# EAGLE design RFBoardLayoutGen0_v03.3JK2 (EAGLE 7.5.0)
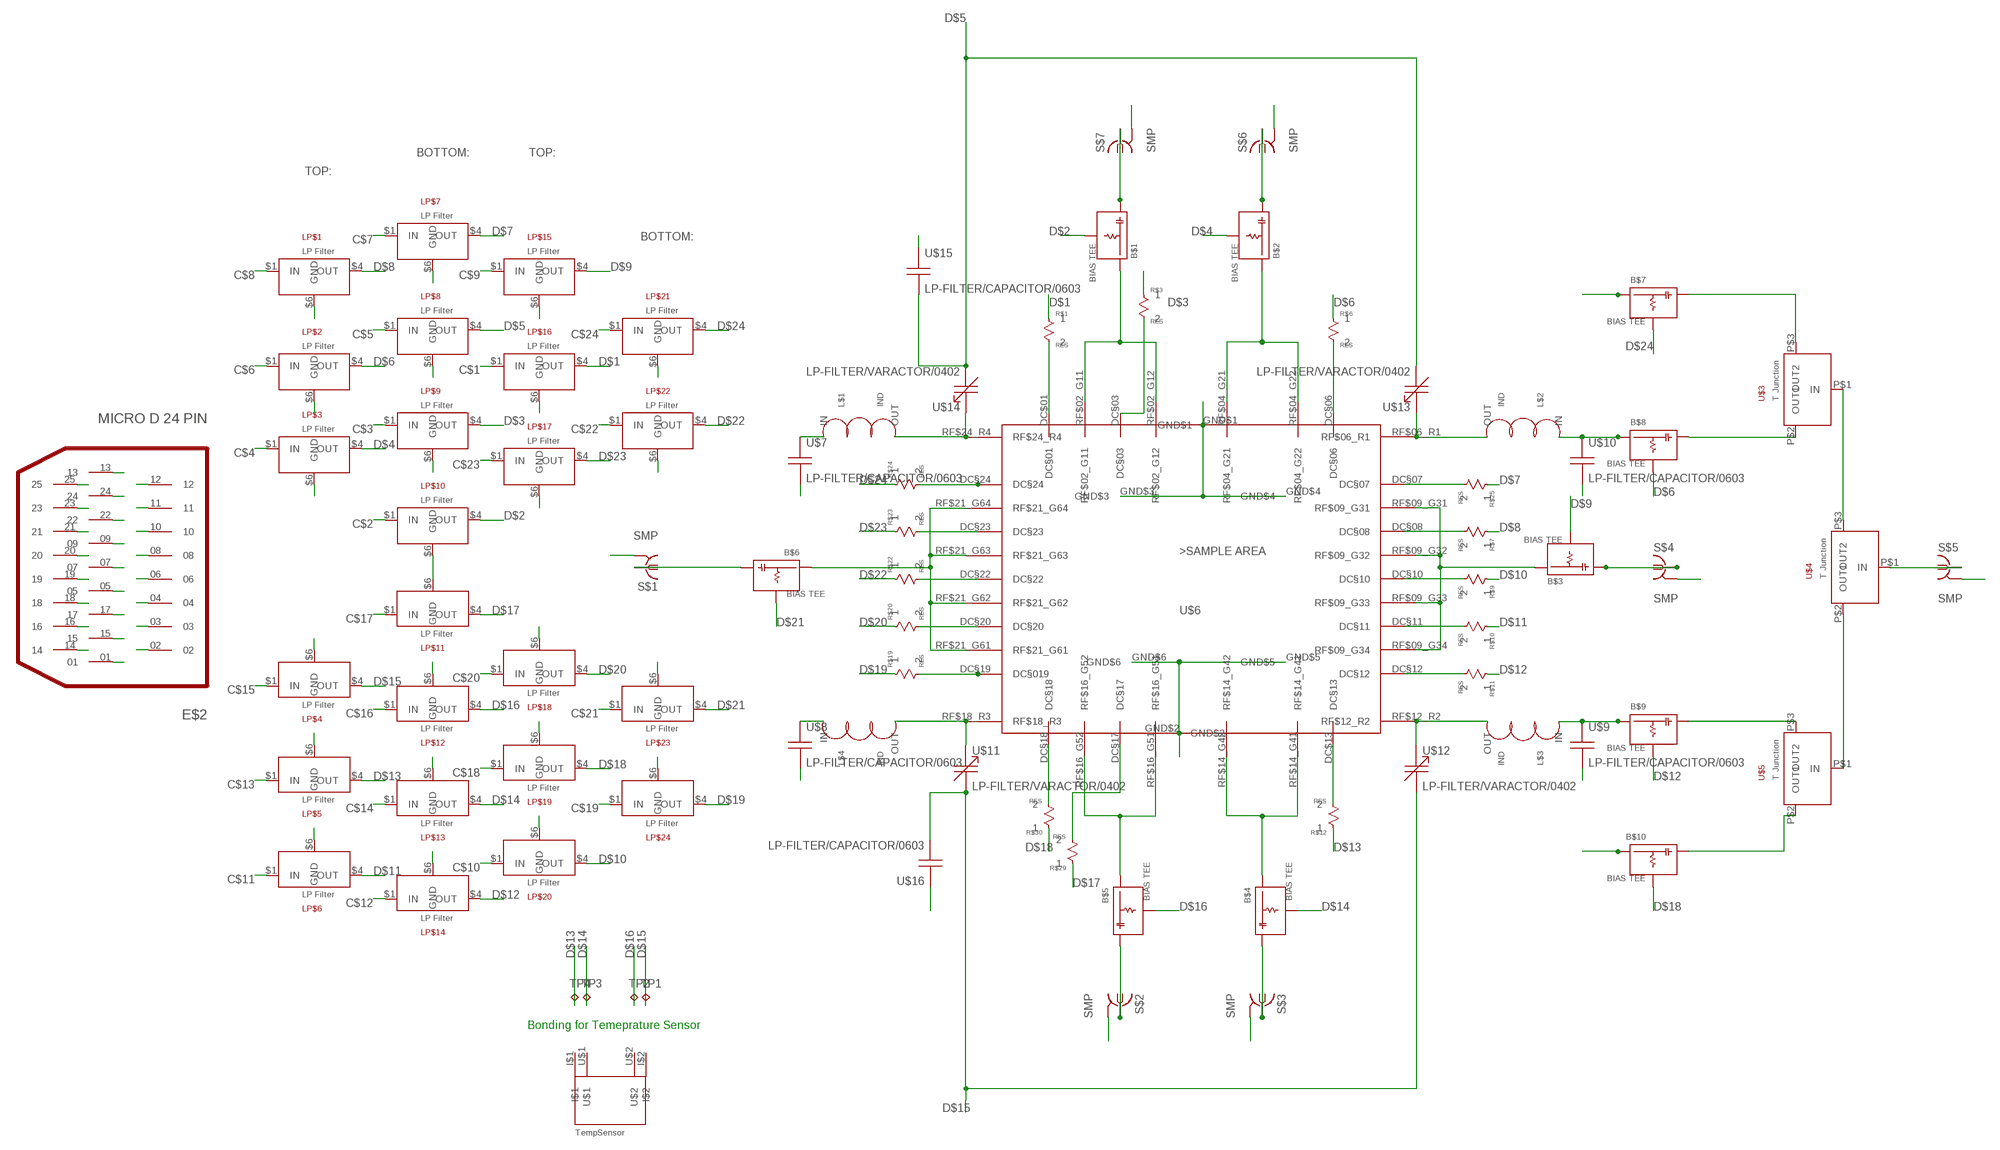
[diagram p0: schematic, sheet 1, part 1 of 2]
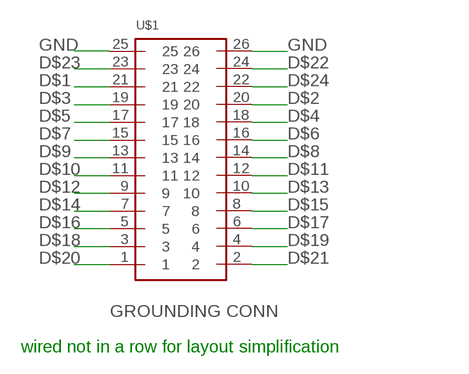
[diagram p1: schematic, sheet 1, part 2 of 2]

## Parts
B$1  BIASTEEDOWN  [BIAS_TEE_DOWN_0603]
B$2  BIASTEEUP  [BIAS_TEE_UP_0603]
B$3  BIASTEEDOWN  [BIAS_TEE_DOWN_0603]
B$4  BIASTEEDOWN  [BIAS_TEE_DOWN_0603]
B$5  BIASTEEUP  [BIAS_TEE_UP_0603]
B$6  BIASTEEDOWN  [BIAS_TEE_DOWN_0603]
B$7  BIASTEEUP  [BIAS_TEE_UP_0603]
B$8  BIASTEEDOWN  [BIAS_TEE_DOWN_0603]
B$9  BIASTEEUP  [BIAS_TEE_UP_0603]
B$10  BIASTEEDOWN  [BIAS_TEE_DOWN_0603]
E$2  25_SOCKET_M83513(13-DPINOUT2  [25_SOCKET_M83513/13-D_V2]
L$1  L_MATCH  [L_MATCH]
L$2  L_MATCH  [L_MATCH]
L$3  L_MATCH  [L_MATCH]
L$4  L_MATCH  [L_MATCH]
LP$1  LP-FILTER/1-STAGETOP  [LP-FILTER/1_STAGE/OS/0603_TOP]
LP$2  LP-FILTER/1-STAGETOP  [LP-FILTER/1_STAGE/OS/0603_TOP]
LP$3  LP-FILTER/1-STAGETOP  [LP-FILTER/1_STAGE/OS/0603_TOP]
LP$4  LP-FILTER/1-STAGETOP  [LP-FILTER/1_STAGE/OS/0603_TOP]
LP$5  LP-FILTER/1-STAGETOP  [LP-FILTER/1_STAGE/OS/0603_TOP]
LP$6  LP-FILTER/1-STAGETOP  [LP-FILTER/1_STAGE/OS/0603_TOP]
LP$7  LP-FILTER/1-STAGEBOT  [LP-FILTER/1_STAGE/OS/0603_BOTTOM]
LP$8  LP-FILTER/1-STAGEBOT  [LP-FILTER/1_STAGE/OS/0603_BOTTOM]
LP$9  LP-FILTER/1-STAGEBOT  [LP-FILTER/1_STAGE/OS/0603_BOTTOM]
LP$10  LP-FILTER/1-STAGEBOT  [LP-FILTER/1_STAGE/OS/0603_BOTTOM]
LP$11  LP-FILTER/1-STAGEBOT  [LP-FILTER/1_STAGE/OS/0603_BOTTOM]
LP$12  LP-FILTER/1-STAGEBOT  [LP-FILTER/1_STAGE/OS/0603_BOTTOM]
LP$13  LP-FILTER/1-STAGEBOT  [LP-FILTER/1_STAGE/OS/0603_BOTTOM]
LP$14  LP-FILTER/1-STAGEBOT  [LP-FILTER/1_STAGE/OS/0603_BOTTOM]
LP$15  LP-FILTER/1-STAGETOP  [LP-FILTER/1_STAGE/OS/0603_TOP]
LP$16  LP-FILTER/1-STAGETOP  [LP-FILTER/1_STAGE/OS/0603_TOP]
LP$17  LP-FILTER/1-STAGETOP  [LP-FILTER/1_STAGE/OS/0603_TOP]
LP$18  LP-FILTER/1-STAGETOP  [LP-FILTER/1_STAGE/OS/0603_TOP]
LP$19  LP-FILTER/1-STAGETOP  [LP-FILTER/1_STAGE/OS/0603_TOP]
LP$20  LP-FILTER/1-STAGETOP  [LP-FILTER/1_STAGE/OS/0603_TOP]
LP$21  LP-FILTER/1-STAGEBOT  [LP-FILTER/1_STAGE/OS/0603_BOTTOM]
LP$22  LP-FILTER/1-STAGEBOT  [LP-FILTER/1_STAGE/OS/0603_BOTTOM]
LP$23  LP-FILTER/1-STAGEBOT  [LP-FILTER/1_STAGE/OS/0603_BOTTOM]
LP$24  LP-FILTER/1-STAGEBOT  [LP-FILTER/1_STAGE/OS/0603_BOTTOM]
R$1  10K  LP-FILTER/RESISTOR/0603  [LP-FILTER/RESISTOR/0603_BOTTOM]
R$3  10K  LP-FILTER/RESISTOR/0603  [LP-FILTER/RESISTOR/0603_BOTTOM]
R$6  10K  LP-FILTER/RESISTOR/0603  [LP-FILTER/RESISTOR/0603_BOTTOM]
R$7  10K  LP-FILTER/RESISTOR/0603  [LP-FILTER/RESISTOR/0603_BOTTOM]
R$9  10K  LP-FILTER/RESISTOR/0603  [LP-FILTER/RESISTOR/0603_BOTTOM]
R$10  10K  LP-FILTER/RESISTOR/0603  [LP-FILTER/RESISTOR/0603_BOTTOM]
R$11  10K  LP-FILTER/RESISTOR/0603  [LP-FILTER/RESISTOR/0603_BOTTOM]
R$12  10K  LP-FILTER/RESISTOR/0603  [LP-FILTER/RESISTOR/0603_BOTTOM]
R$19  10K  LP-FILTER/RESISTOR/0603  [LP-FILTER/RESISTOR/0603_BOTTOM]
R$20  10K  LP-FILTER/RESISTOR/0603  [LP-FILTER/RESISTOR/0603_BOTTOM]
R$22  10K  LP-FILTER/RESISTOR/0603  [LP-FILTER/RESISTOR/0603_BOTTOM]
R$23  10K  LP-FILTER/RESISTOR/0603  [LP-FILTER/RESISTOR/0603_BOTTOM]
R$24  10K  LP-FILTER/RESISTOR/0603  [LP-FILTER/RESISTOR/0603_BOTTOM]
R$25  10K  LP-FILTER/RESISTOR/0603  [LP-FILTER/RESISTOR/0603_BOTTOM]
R$29  10K  LP-FILTER/RESISTOR/0603  [LP-FILTER/RESISTOR/0603_BOTTOM]
R$30  10K  LP-FILTER/RESISTOR/0603  [LP-FILTER/RESISTOR/0603_BOTTOM]
S$1  MC-921WIDE  [SMP_STRAIGHT_MINI_WIDE]
S$2  MC-921WIDE  [SMP_STRAIGHT_MINI_WIDE]
S$3  MC-921WIDE  [SMP_STRAIGHT_MINI_WIDE]
S$4  MC-921WIDE  [SMP_STRAIGHT_MINI_WIDE]
S$5  MC-921WIDE  [SMP_STRAIGHT_MINI_WIDE]
S$6  MC-921WIDE  [SMP_STRAIGHT_MINI_WIDE]
S$7  MC-921WIDE  [SMP_STRAIGHT_MINI_WIDE]
TP1  TPTP07SQ  [TP07SQ]
TP2  TPTP07SQ  [TP07SQ]
TP3  TPTP07SQ  [TP07SQ]
TP4  TPTP07SQ  [TP07SQ]
U$1  MEC8-113-02-L-D-RA1MBRD  [MEC8-113-02-L-D-RA1]
U$2  TEMPSENS  [RX-BR_V1]
U$3  TJUNCTION  [T_JUNCTION_0.3MM]
U$4  TJUNCTION  [T_JUNCTION_0.3MM]
U$5  TJUNCTION  [T_JUNCTION_0.3MM]
U$6  24DC+10RF_V2.0  [24DC+10RF/400MU-PADS/0.7X0.7_V2.0]
U$7  LP-FILTER/CAPACITOR/0603  [LP-FILTER/CAPACITOR/0603_BOTTOM]
U$8  LP-FILTER/CAPACITOR/0603  [LP-FILTER/CAPACITOR/0603_BOTTOM]
U$9  LP-FILTER/CAPACITOR/0603  [LP-FILTER/CAPACITOR/0603_BOTTOM]
U$10  LP-FILTER/CAPACITOR/0603  [LP-FILTER/CAPACITOR/0603_BOTTOM]
U$11  LP-FILTER/VARACTOR/0402  [LP-FILTER/VARACTOR/0402]
U$12  LP-FILTER/VARACTOR/0402  [LP-FILTER/VARACTOR/0402]
U$13  LP-FILTER/VARACTOR/0402  [LP-FILTER/VARACTOR/0402]
U$14  LP-FILTER/VARACTOR/0402  [LP-FILTER/VARACTOR/0402]
U$15  LP-FILTER/CAPACITOR/0603  [LP-FILTER/CAPACITOR/0603_BOTTOM]
U$16  LP-FILTER/CAPACITOR/0603  [LP-FILTER/CAPACITOR/0603_BOTTOM]

## Nets
C$1: E$2.01 LP$16.$1(IN)
C$2: E$2.02 LP$10.$1(IN)
C$3: E$2.03 LP$9.$1(IN)
C$4: E$2.04 LP$3.$1(IN)
C$5: E$2.05 LP$8.$1(IN)
C$6: E$2.06 LP$2.$1(IN)
C$7: E$2.07 LP$7.$1(IN)
C$8: E$2.08 LP$1.$1(IN)
C$9: E$2.09 LP$15.$1(IN)
C$10: E$2.10 LP$20.$1(IN)
C$11: E$2.11 LP$6.$1(IN)
C$12: E$2.12 LP$14.$1(IN)
C$13: E$2.13 LP$5.$1(IN)
C$14: E$2.14 LP$13.$1(IN)
C$15: E$2.15 LP$4.$1(IN)
C$16: E$2.16 LP$12.$1(IN)
C$17: E$2.17 LP$11.$1(IN)
C$18: E$2.18 LP$19.$1(IN)
C$19: E$2.19 LP$24.$1(IN)
C$20: E$2.20 LP$18.$1(IN)
C$21: E$2.21 LP$23.$1(IN)
C$22: E$2.22 LP$22.$1(IN)
C$23: E$2.23 LP$17.$1(IN)
C$24: E$2.24 LP$21.$1(IN)
D$1: LP$16.$4(OUT) R$1.IN U$1.21
D$2: B$1.LF LP$10.$4(OUT) U$1.20
D$3: LP$9.$4(OUT) R$3.IN U$1.19
D$4: B$2.LF LP$3.$4(OUT) U$1.18
D$5: LP$8.$4(OUT) U$1.17 U$13.OUT U$14.OUT U$15.OUT
D$6: B$8.LF LP$2.$4(OUT) R$6.IN U$1.16
D$7: LP$7.$4(OUT) R$25.IN U$1.15
D$8: LP$1.$4(OUT) R$7.IN U$1.14
D$9: B$3.LF LP$15.$4(OUT) U$1.13
D$10: LP$20.$4(OUT) R$9.IN U$1.11
D$11: LP$6.$4(OUT) R$10.IN U$1.12
D$12: B$9.LF LP$14.$4(OUT) R$11.IN U$1.9
D$13: LP$5.$4(OUT) R$12.IN TP4.TP U$1.10
D$14: B$4.LF LP$13.$4(OUT) TP3.TP U$1.7
D$15: LP$4.$4(OUT) TP1.TP U$1.8 U$11.OUT U$12.OUT U$16.OUT
D$16: B$5.LF LP$12.$4(OUT) TP2.TP U$1.5
D$17: LP$11.$4(OUT) R$29.IN U$1.6
D$18: B$10.LF LP$19.$4(OUT) R$30.IN U$1.3
D$19: LP$24.$4(OUT) R$19.IN U$1.4
D$20: LP$18.$4(OUT) R$20.IN U$1.1
D$21: B$6.LF LP$23.$4(OUT) U$1.2
D$22: LP$22.$4(OUT) R$22.IN U$1.24
D$23: LP$17.$4(OUT) R$23.IN U$1.23
D$24: B$7.LF LP$21.$4(OUT) R$24.IN U$1.22
DC$1 [RF2]: R$1.OUT U$6.DC$01(DC§01)
DC$3: R$3.OUT U$6.DC§03
DC$5 [RF2]: B$2.OUT U$6.RF$04_G21 U$6.RF$04_G22
DC$6: R$6.OUT U$6.DC§06
DC$10 [RF2]: B$3.OUT U$6.RF$09_G31 U$6.RF$09_G32 U$6.RF$09_G33 U$6.RF$09_G34
DC$13: R$12.OUT U$6.DC$13(DC§13)
DC$19: R$19.OUT U$6.DC§19(DC§019)
DC$20: R$20.OUT U$6.DC§20
DC$24: R$24.OUT U$6.DC§24
GND: E$2.25 LP$1.$6(GND) LP$2.$6(GND) LP$3.$6(GND) LP$4.$6(GND) LP$5.$6(GND) LP$6.$6(GND) LP$7.$6(GND) LP$8.$6(GND) LP$9.$6(GND) LP$10.$6(GND) LP$11.$6(GND) LP$12.$6(GND) LP$13.$6(GND) LP$14.$6(GND) LP$15.$6(GND) LP$16.$6(GND) LP$17.$6(GND) LP$18.$6(GND) LP$19.$6(GND) LP$20.$6(GND) LP$21.$6(GND) LP$22.$6(GND) LP$23.$6(GND) LP$24.$6(GND) S$1.2@1(GND) S$1.2@2(GND) S$2.2@1(GND) S$2.2@2(GND) S$3.2@1(GND) S$3.2@2(GND) S$4.2@1(GND) S$4.2@2(GND) S$5.2@1(GND) S$5.2@2(GND) S$6.2@1(GND) S$6.2@2(GND) S$7.2@1(GND) S$7.2@2(GND) U$1.25 U$1.26 U$6.GND$1 U$6.GND$2 U$6.GND$3 U$6.GND$4 U$6.GND$5 U$6.GND$6 U$7.OUT U$8.OUT U$9.OUT U$10.OUT U$15.IN U$16.IN
N$1 [RF2]: B$6.HF S$1.1
N$2: L$3.OUT U$6.RF$12_R2 U$12.IN
N$3 [RF2]: B$1.OUT U$6.RF$02_G11 U$6.RF$02_G12
N$4: R$25.OUT U$6.DC§07
N$5 [RF2]: B$1.HF S$7.1
N$6 [RF2]: B$2.HF S$6.1
N$7: B$4.OUT U$6.RF$14_G41 U$6.RF$14_G42
N$8: B$5.OUT U$6.RF$16_G51 U$6.RF$16_G52
N$9 [RF]: L$4.OUT U$6.RF$18_R3 U$11.IN
N$10 [RF]: L$1.OUT U$6.RF$24_R4 U$14.IN
N$11 [RF]: L$2.OUT U$6.RF$06_R1 U$13.IN
N$12: R$7.OUT U$6.DC§08
N$13 [RF]: B$9.OUT L$3.IN U$9.IN
N$14 [RF]: B$8.OUT L$2.IN U$10.IN
N$15 [RF]: B$9.HF U$5.P$3(OUT2)
N$16 [RF2]: B$5.HF S$2.1
N$17 [RF2]: B$4.HF S$3.1
N$18 [RF2]: B$3.HF S$4.1
N$19 [RF]: B$7.HF U$3.P$3(OUT2)
N$20 [RF2]: B$6.OUT U$6.RF$21_G61 U$6.RF$21_G62 U$6.RF$21_G63 U$6.RF$21_G64
N$21 [RF]: S$5.1 U$4.P$1(IN)
N$22 [RF]: B$10.HF U$5.P$2(OUT1)
N$23 [RF]: B$8.HF U$3.P$2(OUT1)
N$24: R$9.OUT U$6.DC§10
N$25 [RF]: U$3.P$1(IN) U$4.P$3(OUT2)
N$26 [RF]: U$4.P$2(OUT1) U$5.P$1(IN)
N$27: R$10.OUT U$6.DC§11
N$28: R$11.OUT U$6.DC§12
N$30: R$29.OUT U$6.DC§17
N$31: R$30.OUT U$6.DC§18
N$32: R$22.OUT U$6.DC§22
N$33: R$23.OUT U$6.DC§23
RF$3 [RF]: B$10.OUT L$4.IN U$8.IN
RF$4 [RF]: B$7.OUT L$1.IN U$7.IN
Unconnected: U$2.I$1 U$2.I$2 U$2.U$1 U$2.U$2

## Notes on the sheet
- BOTTOM: | TOP:
- TOP:
- BOTTOM:
- wired not in a row for layout simplification
- Bonding for Temeprature Sensor

## Library data of the parts
B$1-B$10 = Bias tee:BIASTEE
E$2 = Glenair:25_SOCKET_M83513(13-D
L$1-L$4 = MatchCircuit:L_MATCH
LP$1-LP$24 = LPFilter:LP-FILTER/1-STAGE
R$1 R$3 R$6 R$7 R$9-R$12 R$19 R$20 R$22-R$25 R$29 R$30 = LPFilter:LP-FILTER/RESISTOR/0603
S$1-S$7 = RF Connectors:MC-921: COAX. MICROWAVE CONNECTOR O/D diam 2.1 Source: www.tycoelectronics.com .. Electronics .. ENG_CD_1775146_A2.pdf
TP1-TP4 = testpad:TP: Test pad
U$1 = MEC8-130-02-X-D-RA1:MEC8-113-02-L-D-RA1
U$2 = TempSensors:TEMPSENS
U$3-U$5 = RF layout parts:TJUNCTION
U$6 = SampleArea:24DC+10RF_V2.0
U$7-U$10 U$15 U$16 = LPFilter:LP-FILTER/CAPACITOR/0603
U$11-U$14 = LPFilter:LP-FILTER/VARACTOR/0402

## Net classes
0 GND: clearance 0.15 mm
1 RF: clearance 0.5 mm
2 RF2: width 0.5 mm, clearance 0.41 mm

## Board
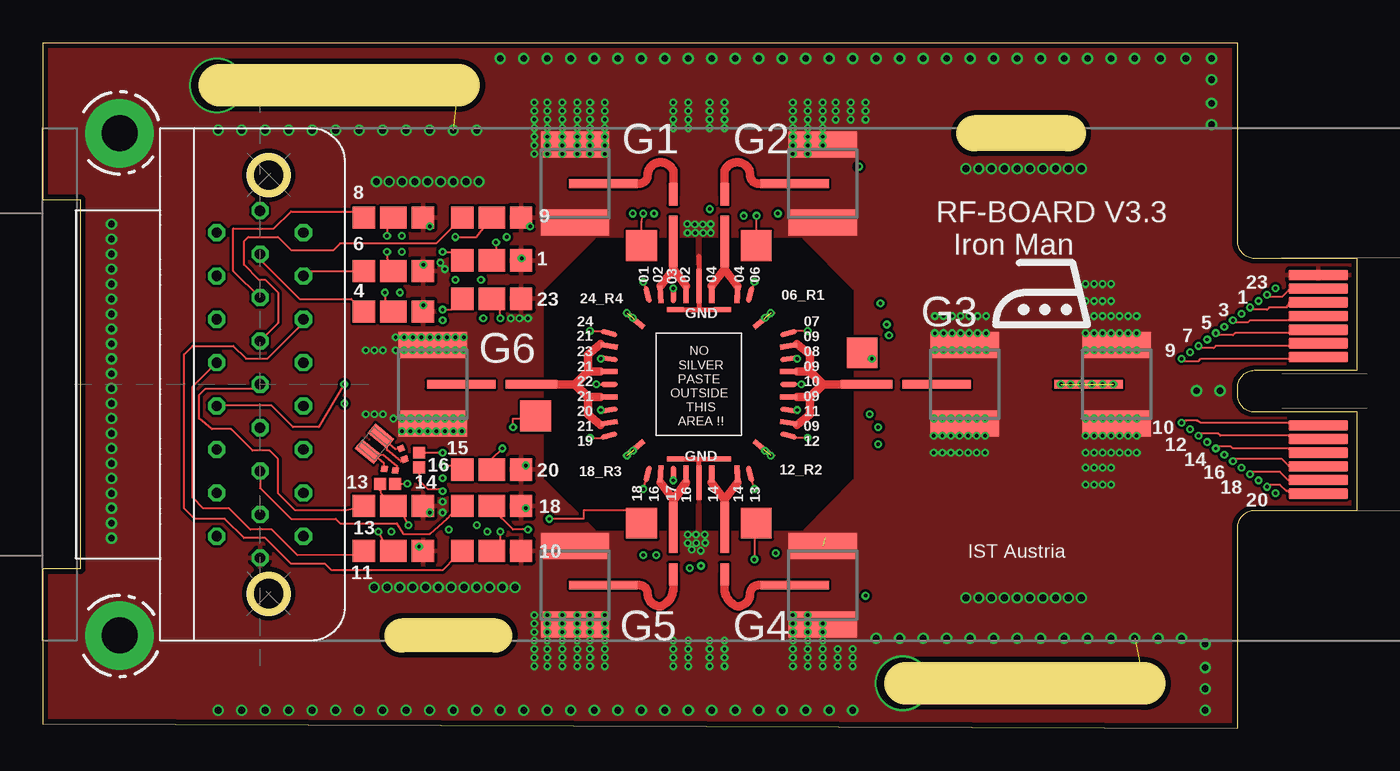
[diagram p2: board, top side]
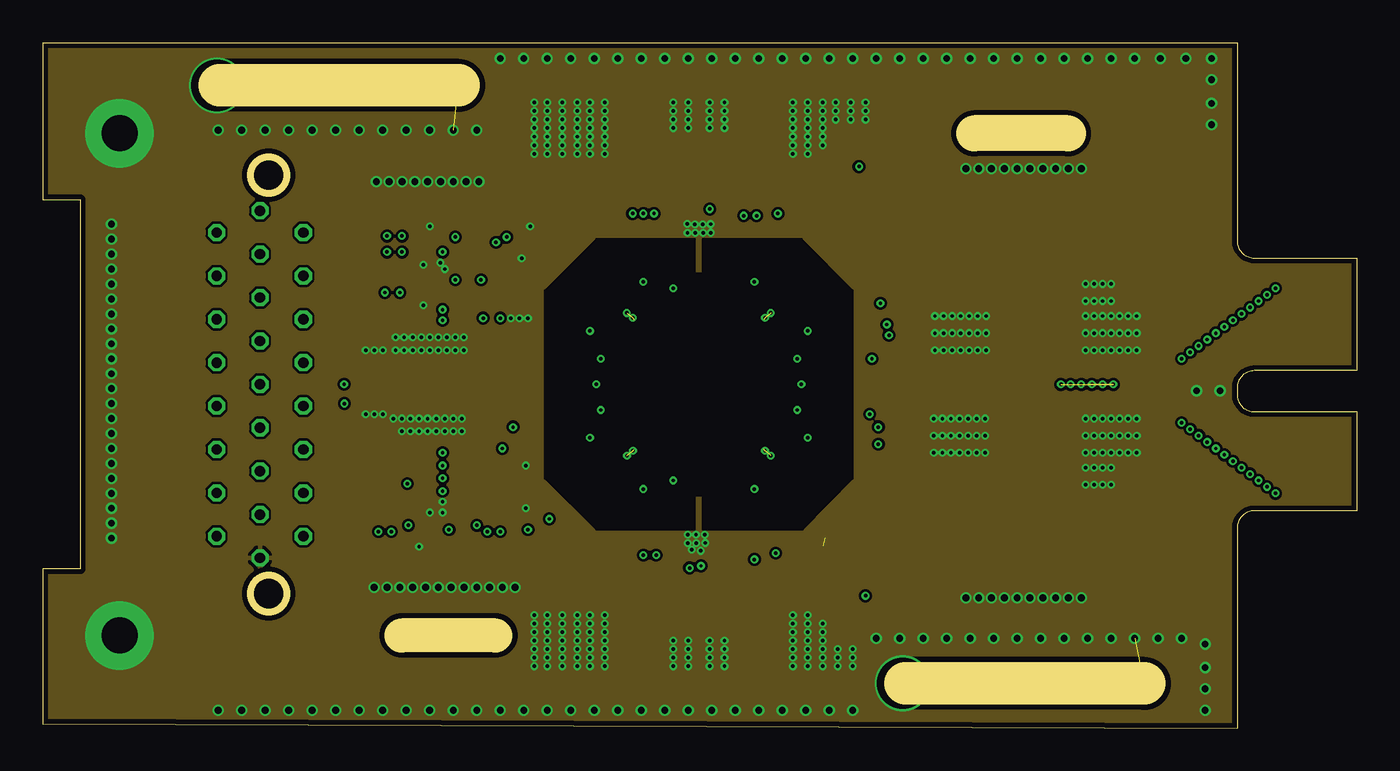
[diagram p3: board, inner layer Route2]
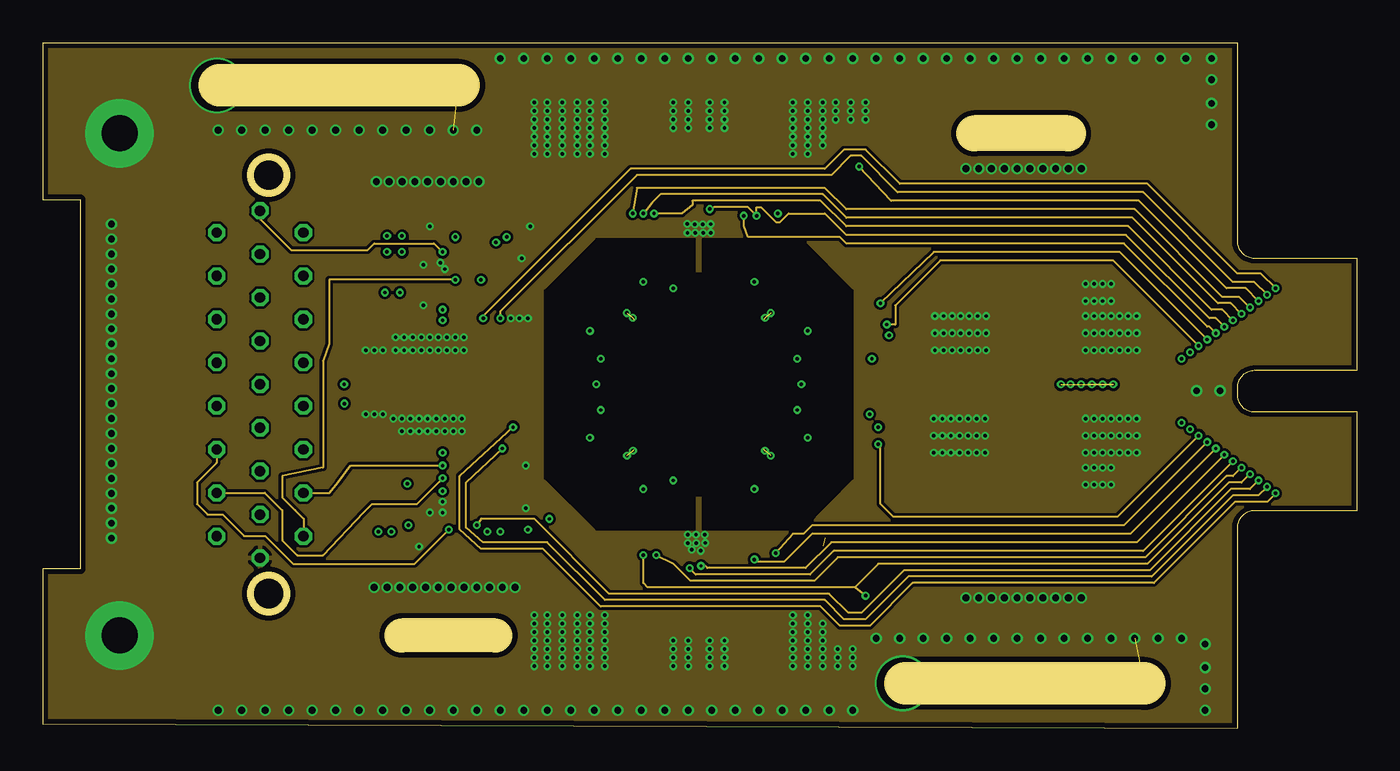
[diagram p4: board, inner layer Route3]
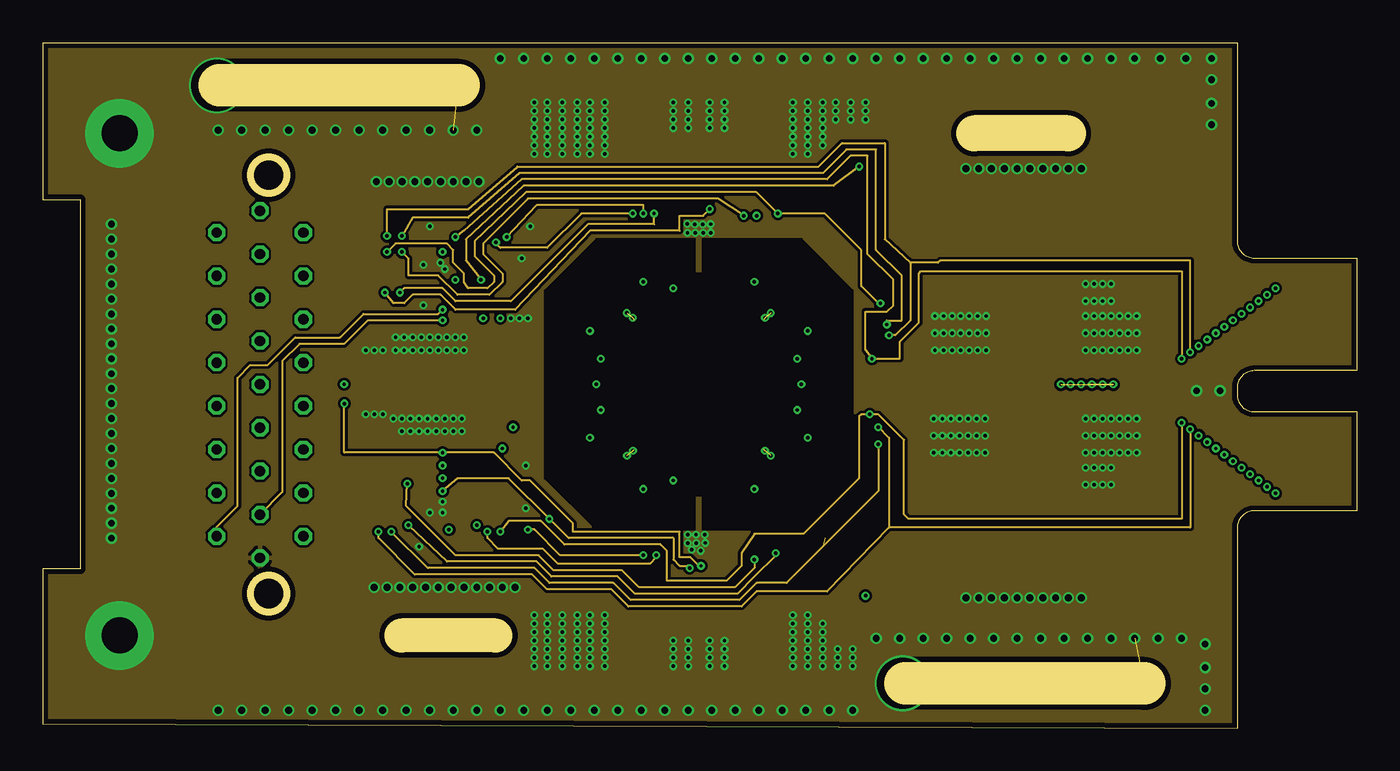
[diagram p5: board, inner layer Route14]
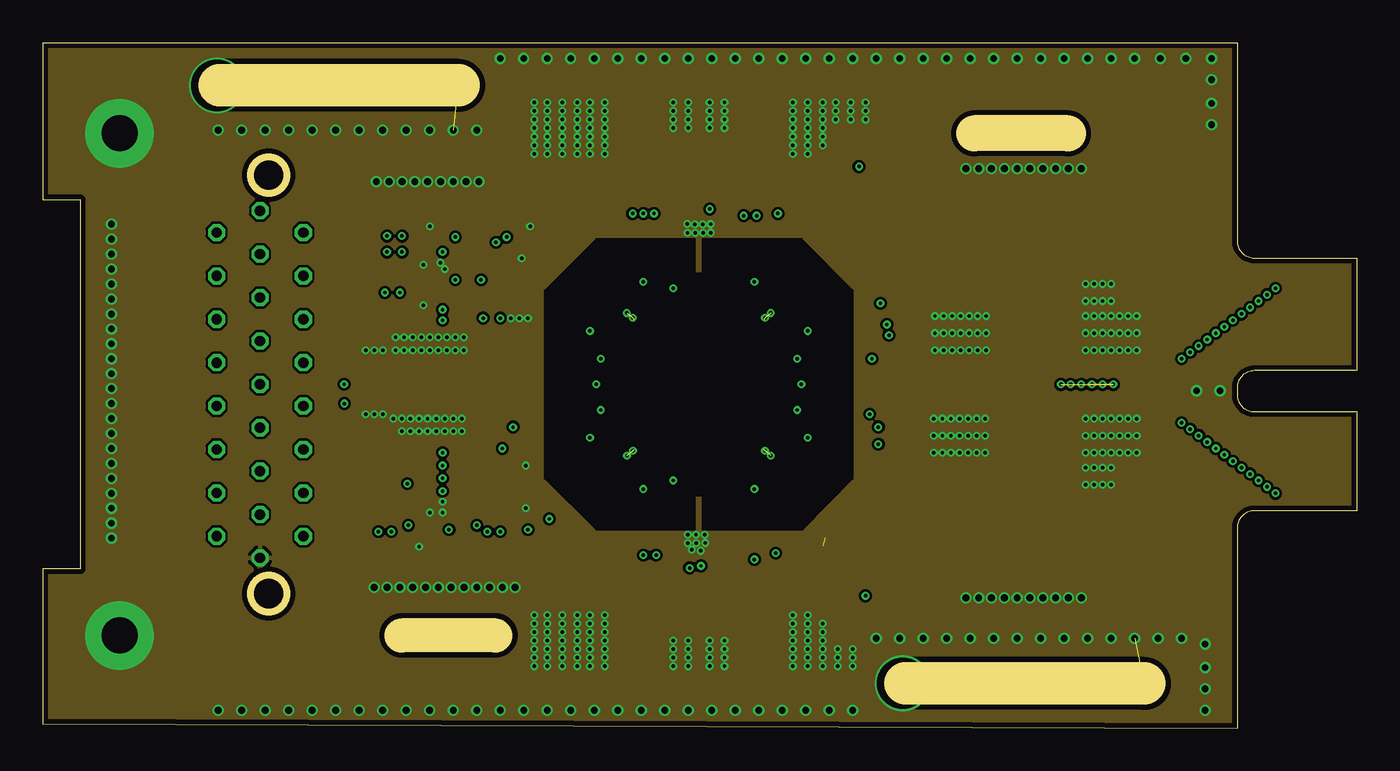
[diagram p6: board, inner layer Route15]
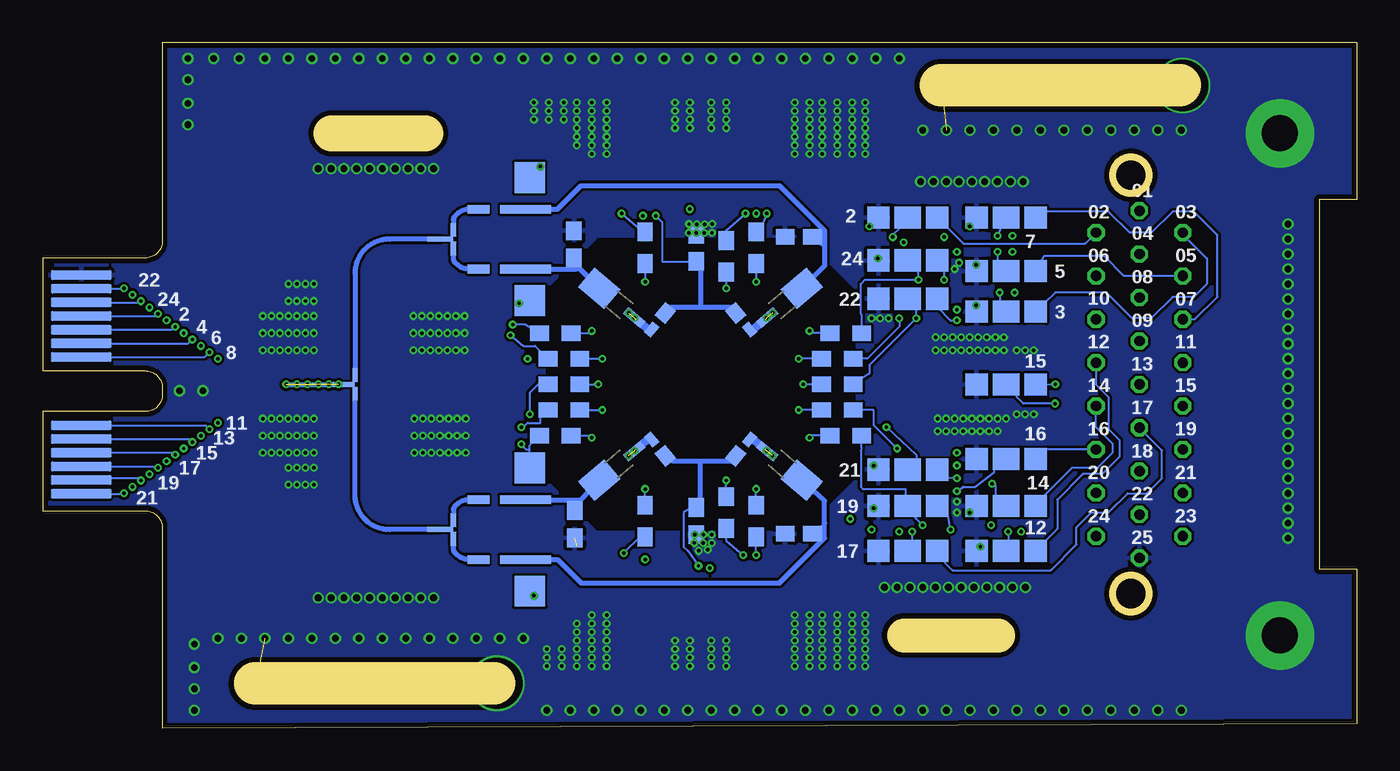
[diagram p7: board, bottom side, seen from below]

Size 76.9 x 40.12 mm. Coordinates in mm from the lower left corner, seen from the top.
Outline: 26.5,5.43 21,5.43
Outline: 60,34.83 54.5,34.83
Outline: 24.35,37.62 10.35,37.62
Outline: 64.47,2.62 50.47,2.62
Outline: 0,40.12 0,30.93 2.2,30.93 2.2,9.32 0,9.32 0,0.25 69.9,0 69.9,11.72 arc-90 70.9,12.72 76.9,12.72 76.9,18.52 70.9,18.52 arc-90 69.9,19.52 69.9,19.93 arc-90 70.9,20.93 76.9,20.93 76.9,27.52 70.9,27.52 arc-90 69.9,28.52 69.9,40.12 0,40.12
Outline: circle at 13.22,7.88 radius 1.06
Outline: circle at 13.22,32.38 radius 1.06
Copper layers (1+2+3*14+15+16): Top 0.035mm / dielectric 0.2mm / Route2 0.035mm / dielectric 0.36mm / Route3 0.035mm / dielectric 0.28mm / Route14 0.035mm / dielectric 0.36mm / Route15 0.035mm / dielectric 0.2mm / Bottom 0.035mm
Design rules "PCB-POOL HighSpec_ML6+ *": minimum track width 0.125mm, minimum drill 0.2mm, track to track 0.125mm, track to pad 0.125mm, pad to pad 0.125mm, via to via 0.125mm, smd to smd 0.125mm, copper to edge 0.3mm, drill to drill 0.2mm, minimum pad ring 0.2mm, minimum via ring 0.125mm, stop-mask expansion 0.065mm, vias tented up to drill 0.3mm, thermal gap 0.2mm

### Footprints (pad centres in the part's own frame; a part is rotated, then mirrored left to right if it is on the bottom)
BIAS_TEE_DOWN_0603 = smd 1.3 x 0.5: HF 3.25,0 | smd 1.8 x 1.8: LF 0.25,1.85 | smd 3 x 0.5: OUT 0.5,0
BIAS_TEE_UP_0603 = smd 1.3 x 0.5: HF 3.25,0 | smd 1.8 x 1.8: LF 0.25,-1.85 | smd 3 x 0.5: OUT 0.5,0
25_SOCKET_M83513/13-D_V2 = drill 0.6 octagon: 01 10.16,0; 02 8.89,-2.54; 03 8.89,2.54; 04 7.62,0; 05 6.35,2.54; 06 6.35,-2.54; 07 3.81,2.54; 08 5.08,0; 09 2.54,0; 10 3.81,-2.54; 11 1.27,2.54; 12 1.27,-2.54; 13 0,0; 14 -1.27,-2.54; 15 -1.27,2.54; 16 -3.81,-2.54; 17 -2.54,0; 18 -5.08,0; 19 -3.81,2.54; 20 -6.35,-2.54; 21 -6.35,2.54; 22 -7.62,0; 23 -8.89,2.54; 24 -8.89,-2.54; 25 -10.16,0
L_MATCH = smd 2 x 1.5: IN 1.5,0 | smd 1.3 x 0.5: OUT -1.15,0
LP-FILTER/1_STAGE/OS/0603_TOP = smd 1.3 x 1.3: $1 -1.6,0.01; $6 1.85,0.01 | smd 1.55 x 1.3: $4 0.125,0.01
LP-FILTER/1_STAGE/OS/0603_BOTTOM = smd 1.3 x 1.3 bottom: $1 -1.6,0.01; $6 1.85,0.01 | smd 1.55 x 1.3 bottom: $4 0.125,0.01
LP-FILTER/RESISTOR/0603_BOTTOM = smd 1.1 x 0.9 bottom: IN -0.925,0; OUT 0.925,0
SMP_STRAIGHT_MINI_WIDE = smd 0.5 x 4: 1 0,1.653 | smd 1.524 x 4: 2@1 -2.292,0; 2@2 2.292,0
TP07SQ = smd 0.7 x 0.7: TP 0,0
MEC8-113-02-L-D-RA1 = smd 0.6 x 3.5: 1 6.4,0.15; 3 5.6,0.15; 5 4.8,0.15; 7 4,0.15; 9 3.2,0.15; 11 2.4,0.15; 13 -1.6,0.15; 15 -2.4,0.15; 17 -3.2,0.15; 19 -4,0.15; 21 -4.8,0.15; 23 -5.6,0.15; 25 -6.4,0.15 | smd 0.6 x 3.5 bottom: 2 6.4,0.15; 4 5.6,0.15; 6 4.8,0.15; 8 4,0.15; 10 3.2,0.15; 12 2.4,0.15; 14 -1.6,0.15; 16 -2.4,0.15; 18 -3.2,0.15; 20 -4,0.15; 22 -4.8,0.15; 24 -5.6,0.15; 26 -6.4,0.15
RX-BR_V1 = smd 0.406 x 0.406 rotated 105: I$1 -0.02,1.08; U$1 0.63,1.23 | smd 0.406 x 0.406 rotated 165: I$2 1.08,-0.02; U$2 1.23,0.63 | smd 1.422 x 0.711 rotated 45: P$2 -0.02,-0.87; P$3 -0.87,-0.02
T_JUNCTION_0.3MM = smd 0.3 x 1.5 bottom: P$1 0,-0.75 | smd 0.8 x 0.3 bottom: P$2 -0.55,0.03; P$3 0.55,0.03 | smd 1 x 0.125 bottom: P$4 0,-0.06
24DC+10RF/400MU-PADS/0.7X0.7_V2.0 = smd 1 x 0.3 rotated 105: DC$01 -3,5.25; DC$13 3,-5.25 | smd 0.3 x 1: DC§03 -1.5,5.25; DC§17 -1.5,-5.25; RF$02_G12 -0.75,5.25; RF$04_G21 0.75,5.25; RF$14_G42 0.75,-5.25; RF$16_G51 -0.75,-5.25 | smd 1 x 0.3 rotated 75: DC§06 3,5.25; DC§18 -3,-5.25 | smd 1 x 0.3 rotated 195: DC§07 5.25,3 | smd 1 x 0.3 rotated 189: DC§08 5.25,1.5; RF$09_G31 5.25,2.25 | smd 1 x 0.3: DC§10 5.25,0; DC§22 -5.25,0; GND$3 -1.375,4.375; GND$4 1.375,4.375; GND$5 1.375,-4.375; GND$6 -1.375,-4.375; RF$09_G32 5.25,0.75; RF$09_G33 5.25,-0.75; RF$21_G62 -5.25,-0.75; RF$21_G63 -5.25,0.75 | smd 1 x 0.3 rotated 171: DC§11 5.25,-1.5; RF$09_G34 5.25,-2.25 | smd 1 x 0.3 rotated 165: DC§12 5.25,-3 | smd 1 x 0.3 rotated 15: DC§19 -5.25,-3 | smd 1 x 0.3 rotated 9: DC§20 -5.25,-1.5; RF$21_G61 -5.25,-2.25 | smd 1 x 0.3 rotated 351: DC§23 -5.25,1.5; RF$21_G64 -5.25,2.25 | smd 1 x 0.3 rotated 345: DC§24 -5.25,3 | smd 0.3 x 2: GND$1 0,5.75; GND$2 0,-5.75 | smd 1 x 0.3 rotated 93: RF$02_G11 -2.25,5.25; RF$14_G41 2.25,-5.25 | smd 1 x 0.3 rotated 87: RF$04_G22 2.25,5.25; RF$16_G52 -2.25,-5.25 | smd 1.5 x 0.3 rotated 40: RF$06_R1 3.8,3.8; RF$18_R3 -3.8,-3.8 | smd 1.5 x 0.3 rotated 140: RF$12_R2 3.8,-3.8; RF$24_R4 -3.8,3.8
LP-FILTER/CAPACITOR/0603_BOTTOM = smd 1.1 x 0.9 bottom: IN -0.8,0; OUT 0.8,0
LP-FILTER/VARACTOR/0402 = smd 0.8 x 0.5 bottom: IN -0.55,0 | smd 1 x 0.8 bottom: OUT 0.7,0

### Placement (x,y rotation side)
B$1  36.9,28 90 top
B$2  39.9,28 90 top
B$3  47.71,20.12 0 top
B$4  39.9,12.25 270 top
B$5  36.9,12.25 270 top
B$6  29.09,20.12 180 top
B$7  48.15,30.38 180 bottom
B$8  48.15,26.88 180 bottom
B$9  48.15,13.38 180 bottom
B$10  48.15,9.88 180 bottom
E$2  12.71,20.12 90 top
L$1  33.62,24.77 40 bottom
L$2  43.17,24.77 140 bottom
L$3  43.17,15.47 220 bottom
L$4  33.63,15.47 320 bottom
LP$1  20.4,29.88 0 top
LP$2  20.4,26.75 0 top
LP$3  20.4,24.38 0 top
LP$4  20.4,20.12 180 bottom
LP$5  20.4,13 0 top
LP$6  20.4,10.38 0 top
LP$7  20.4,29.88 0 top
LP$8  20.4,26.75 0 top
LP$9  20.4,24.38 0 top
LP$10  26.15,29.88 0 top
LP$11  26.15,10.38 0 top
LP$12  20.4,15.75 0 top
LP$13  20.4,13 0 top
LP$14  20.4,10.38 0 top
LP$15  26.15,29.88 0 top
LP$16  26.15,27.38 0 top
LP$17  26.15,25.12 0 top
LP$18  26.15,15.12 0 top
LP$19  26.15,13 0 top
LP$20  26.15,10.38 0 top
LP$21  26.15,27.38 0 top
LP$22  26.15,25.12 0 top
LP$23  26.15,15.12 0 top
LP$24  26.15,13 0 top
R$1  35.15,28.12 270 top
R$3  36.9,27.62 270 top
R$6  41.65,28.12 270 top
R$7  46.4,21.62 180 top
R$9  46.4,20.12 180 top
R$10  46.4,18.62 180 top
R$11  46.9,17.12 180 top
R$12  41.65,12.12 90 top
R$19  29.9,17.12 0 top
R$20  30.4,18.62 0 top
R$22  30.4,20.12 0 top
R$23  30.4,21.62 0 top
R$24  29.9,23.12 0 top
R$25  46.9,23.12 180 top
R$29  36.9,12.62 90 top
R$30  35.15,12.12 90 top
S$1  22.84,20.12 270 top
S$2  31.15,8.38 270 top
S$3  45.65,8.38 90 top
S$4  53.96,20.12 90 top
S$5  62.85,20.12 90 top
S$6  45.65,31.88 90 top
S$7  31.15,31.88 270 top
TP1  22.02,16.12 0 top
TP2  22.02,15.25 0 top
TP3  20.62,14.31 0 top
TP4  19.74,14.31 90 top
U$1  74.5,20.12 270 top
U$2  19.9,16.25 275.6 top
U$3  52.9,28.62 90 top
U$4  58.65,20.12 90 top
U$5  52.9,11.62 90 top
U$6  38.4,20.12 0 top
U$7  32.65,28.75 0 top
U$8  32.65,11.38 0 top
U$9  45.77,11.94 270 top
U$10  45.81,28.31 90 top
U$11  35.89,16.48 310 top
U$12  40.91,16.48 230 top
U$13  40.91,23.77 130 top
U$14  35.89,23.77 50 top
U$15  38.65,28.12 270 top
U$16  38.65,12.12 90 top

### Tracks (layer width: path | path; a pad name or v marks a point on that pad's centre or on a via)
C$1  (via drill 0.2)
  Top 0.125: v23.4,27.88 24.18,27.88 LP$16.$1
  Route3 0.125: E$2.01 12.71,29.81 14.52,28 19.02,28 19.4,28.38 22.9,28.38 v23.4,27.88
C$2
  Bottom 0.125: LP$10.$1 24.53,29.88 23.02,28.38 15.89,28.38 E$2.02
C$3
  Bottom 0.125: 10.17,28.9 8.77,27.5 8.77,26 9.52,25.25 10.77,25.25 12.02,24 13.15,24 14.65,25.5 17.65,25.5 18.27,24.88 18.31,24.88
  Bottom 0.3: E$2.03 10.17,28.9 | 18.31,24.88 LP$9.$1
C$4
  Top 0.125: LP$3.$1 18.06,25.12 15.02,25.12 12.71,27.43 E$2.04
C$5
  Bottom 0.125: E$2.05 13.62,26.48 14.77,27.62 18.31,27.62 LP$8.$1
C$6
  Top 0.125: E$2.06 15.52,26.75 LP$2.$1
C$7
  Bottom 0.125: E$2.07 9.46,23.93 8.15,25.25 8.15,28.88 9.52,30.25 10.77,30.25 12.02,29 13.27,29 14.52,30.25 18.43,30.25 LP$7.$1
C$8
  Top 0.125: LP$1.$1 18.4,29.88 18.27,30.25 14.52,30.25 13.52,29.25 11.15,29.25 11.15,26.77 E$2.08
  Top 0.3: LP$1.$1
C$9
  Top 0.125: LP$15.$1 24.3,29.65 23.02,28.38 17.4,28.38 17.02,28 14.52,28 13.77,28.75 12.02,28.75 11.77,28.5 11.77,27.12 12.65,26.25 13.02,26.25 13.77,25.5 13.77,23.73 E$2.09
C$10
  Top 0.125: LP$20.$1 24.17,10.03 23.4,9.25 16.9,9.25 16.52,9.62 14.52,9.62 13.02,11.12 11.77,11.12 10.65,12.25 8.9,12.25 8.27,12.88 8.27,21.88 8.77,22.38 11.15,22.38 11.9,21.62 13.15,21.62 15.02,23.5 15.07,23.75 E$2.10
C$11
  Top 0.125: LP$6.$1 18.54,10.38 18.27,10.12 14.89,10.13 13.4,11.62 12.15,11.62 10.9,12.88 9.4,12.88 8.77,13.5 8.77,20 E$2.11
C$12
  Bottom 0.125: E$2.12 15.25,20.11 14.52,19.38 14.52,17.5 13.9,16.88 13.9,15.88 14.9,14.88 16.02,14.88 17.52,13.38 17.52,11.66 LP$14.$1
C$13
  Top 0.125: LP$5.$1 18.8,12.97 17.77,12.75 14.77,12.75 13.77,13.75 13.77,15.75 13.27,16.25 12.27,16.25 11.02,17.5 9.9,17.5 9.15,18.12 9.15,19.5 9.52,19.88 12.46,19.88 E$2.13
C$14
  Bottom 0.125: LP$13.$1 18.55,13.35 16.65,15.25 15.15,15.25 14.27,16.12 14.27,16.62 15.27,17.62 15.27,18.84 E$2.14
C$15  (via drill 0.2)
  Top 0.125: v17.64,20.14 16.15,17.62 14.65,17.62 13.4,18.88 10.2,18.88 E$2.15
  Bottom 0.125: LP$4.$1 v17.64,20.14
C$16
  Bottom 0.125: E$2.16 18.37,16.32 LP$12.$1
C$17
  Bottom 0.125: LP$11.$1 24.53,10.13 23.65,9.25 17.9,9.25 16.4,10.75 16.4,11.75 15.52,12.62 14.52,12.62 13.4,13.75 12.27,13.75 11.4,14.62 11.4,16.27 E$2.17
C$18
  Top 0.125: E$2.18 12.71,14.06 14.52,12.25 17.15,12.25 17.4,12 20.71,12 21.09,11.38 22.66,11.38 23.65,12.25 23.9,12.5 LP$19.$1
C$19  (via drill 0.2)
  Route3 0.125: E$2.19 10.17,15.53 9.02,14.38 9.02,13.12 9.65,12.5 10.52,12.5 11.77,11.25 13.02,11.25 14.65,9.62 21.77,9.62 v23.77,11.62
  Bottom 0.125: v23.77,11.62 23.9,12.36 LP$24.$1
C$20  (via drill 0.2)
  Top 0.125: 24.04,14.62 LP$18.$1 24.31,15.38 v23.4,15.38
  Route3 0.125: E$2.20 16.8,13.78 17.27,14.38 18.02,15.38 v23.4,15.38
C$21  (via drill 0.2)
  Route3 0.125: E$2.21 13,13.78 14.02,12.75 14.02,11 14.9,10.12 16.4,10.12 18.77,12.62 19.27,13.12 21.9,13.12 v23.4,14.62
  Bottom 0.125: v23.4,14.62 24.46,14.66 LP$23.$1
C$22  (via drill 0.2)
  Route14 0.125: v23.4,23.88 19.02,23.88 17.65,22.5 15.02,22.5 14.02,21.5 14.02,13.82 E$2.22
  Bottom 0.125: LP$22.$1 24.55,24.65 23.77,23.88 v23.4,23.88
C$23  (via drill 0.2)
  Top 0.125: 24.55,24.65 LP$17.$1 23.91,24.5 v23.4,24.5
  Route14 0.125: E$2.23 10.17,11.78 11.4,13 11.4,20.5 12.15,21.25 13.15,21.25 14.77,22.88 17.4,22.88 18.77,24.25 23.15,24.25 v23.4,24.5
C$24  (via drill 0.2)
  Route3 0.125: v24.15,26.25 16.77,26.25 16.77,22.5 16.4,21.5 16.4,15.25 14.02,14.75 14.02,13.5 14.77,12.75 15.27,12.25 E$2.24
  Bottom 0.125: LP$21.$1 24.17,26.77 v24.15,26.25
D$1  (via drill 0.2)
  Top 0.125: v26.52,28.44 26.52,27.5 LP$16.$4 | U$1.21 72.95,24.93 72.78,24.62 71.78,24.62 71.65,24.5 70.78,24.5 v70.65,24.62
  Route3 0.125: v70.65,24.62 70.03,25.25 69.03,25.25 63.9,30.38 47.02,30.38 45.77,31.62 34.77,31.62 v34.52,30.12
  Route14 0.125: v34.52,30.12 31.52,30.12 29.52,28.12 26.77,28.12 26.52,28.38 v26.52,28.44
  Bottom 0.125: v34.52,30.12 34.9,29.12 34.9,29.05 R$1.IN
D$2  (via drill 0.2)
  Top 0.125: B$1.LF 35.05,29.65 v35.15,30.12
  Route3 0.125: v70.15,24.25 69.53,24.88 68.78,24.88 63.77,29.88 47.02,29.88 45.65,31.25 36.15,31.25 35.65,30.75 v35.15,30.12
  Route14 0.125: v35.15,30.12 35.15,30.62 28.9,30.62 v27.15,28.75
  Bottom 0.125: v27.15,28.75 v27.14,28.75 27.14,28.88 26.77,29.25 LP$10.$4 | U$1.20 70.28,24.12 v70.15,24.25
D$3  (via drill 0.2)
  Top 0.125: U$1.19 73.03,24 72.9,23.88 70.65,23.88 70.53,23.75 69.78,23.75 v69.65,23.88
  Route3 0.125: v69.65,23.88 69.03,24.5 68.4,24.5 63.52,29.38 47.02,29.38 45.52,30.88 38.02,30.88 38.02,30.62 37.4,30.12 v35.77,30.12
  Route14 0.125: v20.9,25.5 21.15,25.75 23.4,25.75 24.15,25 27.4,25 31.9,29.5 35.77,29.5 v35.77,30.12
  Bottom 0.125: v20.9,25.5 20.9,24.12 LP$9.$4 | R$3.IN 36.9,29.12 v35.77,30.12
D$4  (via drill 0.2)
  Top 0.125: v20.02,25.5 20.02,24.62 19.9,23.88 LP$3.$4 | B$2.LF 41.77,28.27 v41.77,30
  Route3 0.125: v69.15,23.5 68.65,24 68.28,24 63.4,28.88 47.02,28.88 45.77,30.12 43.65,30.12 43.15,29.62 42.9,29.62 42.02,30.5 41.77,30.5 v41.77,30 41.27,30.5 39.27,30.5 v39.04,30.39
  Route14 0.125: v20.02,25.5 20.52,24.88 21.15,24.88 21.65,25.38 23.27,25.38 24.15,24.5 27.65,24.5 32.02,29.12 37.27,29.12 37.27,30 38.65,30 v39.04,30.39
  Bottom 0.125: U$1.18 69.33,23.32 v69.15,23.5
D$5  (via drill 0.2)
  Top 0.125: U$1.17 74.45,23.2 73.03,23.12 69.78,23.12 69.65,23 68.78,23 v68.65,23.12
  Route3 0.125: v68.65,23.12 68.28,23.5 68.15,23.5 63.27,28.38 47.02,28.38 46.65,28.75 41.27,28.75 41.02,29.38 v41.02,30
  Route14 0.125: v41.02,30 39.52,31 28.4,31 25.77,28.38 25.77,27.75 26.9,26.62 26.9,26.12 26.15,25.38 24.27,25.38 23.15,26.5 21.4,26.5 21.4,27.5 v21.02,27.88
  Bottom 0.125: v21.02,27.88 21.02,27.38 LP$8.$4 | v41.02,30 40.65,29.62 40.65,27.32 U$15.OUT
  Bottom 0.3: U$14.OUT 36.59,24.62 38.4,24.62 | 38.4,24.62 40.21,24.62 U$13.OUT | U$15.OUT 38.4,27.21 38.4,24.62
D$6  (via drill 0.2)
  Top 0.125: v20.15,27.88 20.15,27.51 LP$2.$4
  Route3 0.125: v68.15,22.75 63.02,27.88 52.15,27.88 v49.02,24.88
  Route14 0.125: v49.02,24.88 48.9,24.88 47.9,25.88 47.9,28 45.77,30.12 v43.02,30.12 41.77,31.38 28.27,31.38 25.27,28.5 25.27,27.62 26.4,26.5 26.4,26.12 26.02,25.75 24.9,25.75 24.65,26.12 24.65,26.62 24.02,27.25 24.02,28 23.65,28.38 20.65,28.38 v20.15,27.88
  Bottom 0.125: v43.02,30.12 41.9,29.12 41.73,29.12 R$6.IN | B$8.LF 48.75,25.27 v49.02,24.88 | U$1.16 68.38,22.52 v68.15,22.75
D$7  (via drill 0.2)
  Top 0.125: U$1.15 74.42,22.4 73.05,22.4 73.03,22.38 68.65,22.38 68.53,22.25 67.78,22.25 v67.65,22.38
  Route3 0.125: v67.65,22.38 62.65,27.38 52.52,27.38 49.9,24.75 49.9,23.62 v49.4,23.62
  Route14 0.125: v49.4,23.62 49.4,23.88 50.27,23.88 50.27,26.5 48.77,28 48.77,33.88 47.02,33.88 45.65,32.5 27.9,32.5 24.9,29.88 21.65,29.88 v21.02,28.81
  Bottom 0.125: v49.4,23.62 48.65,23.62 R$25.IN | v21.02,28.81 LP$7.$4
D$8  (via drill 0.2)
  Top 0.125: LP$1.$4 20.15,29.62 v20.15,28.81
  Route14 0.125: v20.15,28.81 20.15,30.38 24.9,30.38 27.77,32.88 45.4,32.88 46.77,34.25 49.27,34.25 49.27,28.62 50.77,27.25 | v67.15,22 67.15,27.38 52.52,27.38 52.4,27.25 50.77,27.25 | 50.77,27.25 50.77,23.88 49.9,23 v49.52,23
  Bottom 0.125: U$1.14 67.42,21.73 v67.15,22 | v49.52,23 48.77,22.38 48.08,22.38 R$7.IN
D$9  (via drill 0.2)
  Top 0.125: v24.15,28.75 25.4,28.76 LP$15.$4 | 47.9,21.75 48.02,21.75 v48.52,21.62 48.52,21.98 B$3.LF | v66.65,21.62 66.78,21.5 67.65,21.5 67.78,21.62 74.55,21.62 U$1.13
  Route14 0.125: v24.15,28.75 24.65,29.12 28.02,32.12 45.9,32.12 47.27,33.5 48.27,33.5 48.27,27.75 49.77,26.25 49.77,24.75 49.4,24.38 48.15,24.38 48.15,22.12 v48.52,21.62 50.15,21.62 50.15,22.62 51.27,23.75 51.27,26.62 51.4,26.75 66.65,26.75 v66.65,21.62
D$10  (via drill 0.2)
  Top 0.125: v26.77,11.5 26.77,10.75 26.65,10.76 LP$20.$4 | U$1.11 73.05,17.73 72.9,17.88 67.78,17.88 67.53,18 66.9,18 v66.65,17.88
  Route14 0.125: v26.77,11.5 27.27,12.12 29.15,12.12 30.52,10.75 36.15,10.75 36.52,10.38 36.52,8.62 40.02,8.62 40.9,9.5 40.9,10.25 41.65,11.38 44.52,11.38 47.77,14.62 47.77,18.25 47.9,18.38 v48.4,18.38 48.9,18.38 50.4,16.88 50.4,12.5 50.65,12.25 66.65,12.25 v66.65,17.88
  Bottom 0.125: v48.4,18.38 48.4,19.62 47.9,20.12 R$9.IN
D$11  (via drill 0.2)
  Top 0.125: v19.65,11.5 19.9,11 19.9,10.75 LP$6.$4
  Route14 0.125: v48.9,17.62 49.52,17 49.52,11.75 | 49.52,11.75 45.9,8 41.77,8 40.9,7.12 34.27,7.12 33.27,8.12 29.52,8.12 28.65,9 21.77,9 19.65,11.12 v19.65,11.5 | v67.15,17.5 67.15,11.75 49.52,11.75
  Bottom 0.125: U$1.12 67.38,17.73 v67.15,17.5 | v48.9,17.62 48.77,17.62 48.52,17.88 47.77,17.88 47.77,18.18 R$10.IN
D$12  (via drill 0.2)
  Top 0.125: U$1.9 73.1,16.93 72.9,17.12 68.9,17.12 68.78,17.25 67.78,17.25 v67.65,17.12
  Route3 0.125: v67.65,17.12 62.9,12.38 49.77,12.38 49.02,13.12 49.02,16.5 v48.9,16.62
  Route14 0.125: v48.9,16.62 48.9,13.88 43.52,8.5 41.77,8.5 40.77,7.5 34.4,7.5 33.4,8.5 29.65,8.5 28.77,9.38 22.52,9.38 v20.4,11.5
  Bottom 0.125: B$9.LF 48.4,16.3 | v20.4,11.5 20.4,11 LP$14.$4 | 48.4,16.3 48.58,16.3 v48.9,16.62 | 48.4,16.3 48.4,16.55 R$11.IN
D$13  (via drill 0.2)
  Top 0.125: v21.4,11.88 21.15,12.38 20.27,12.88 LP$5.$4 19.77,13.76 19.77,13.88 19.49,14.16 TP4.TP
  Route3 0.125: v68.15,16.75 63.27,11.88 45.02,11.88 44.52,11.38 43.9,11.38 v42.9,10.25
  Route14 0.125: v42.9,10.25 42.9,10.12 41.65,8.88 40.65,7.88 34.65,7.88 33.65,8.88 29.77,8.88 28.9,9.75 23.65,9.75 v21.4,11.88
  Bottom 0.125: v42.9,10.25 41.95,11.2 R$12.IN | U$1.10 68.33,16.93 v68.15,16.75
D$14  (via drill 0.2)
  Top 0.125: TP3.TP v21.34,14.31 | U$1.7 73.15,16.12 72.9,16.38 69.65,16.38 69.53,16.5 68.78,16.5 v68.65,16.38 | B$4.LF 41.65,11.9 v41.65,9.88
  Route3 0.125: v68.65,16.38 63.65,11.38 45.02,11.38 43.4,9.75 41.77,9.75 v41.65,9.88
  Route14 0.125: v41.65,9.88 41.65,9.38 40.52,8.25 34.9,8.25 33.9,9.25 29.9,9.25 29.02,10.12 24.15,10.12 21.27,13 v21.34,14.31
  Bottom 0.125: v21.34,14.31 21.15,14.25 21.15,13.12 LP$13.$4
D$15  (via drill 0.2)
  Top 0.125: TP1.TP v23.4,16.12
  Route3 0.125: v69.15,16 64.03,10.88 46.15,10.88 44.65,9.38 38.9,9.38 38.77,9.5 v38.52,9.5
  Route14 0.125: v38.52,9.5 38.4,9.5 37.9,10 37.27,10 37.27,11.5 31.02,11.5 31.02,12 28.52,14.5 28.02,14.5 26.4,16.12 v23.4,16.12 17.65,16.12 v17.65,19
  Bottom 0.125: U$1.8 69.28,16.12 v69.15,16 | v17.65,19 19.52,19 19.9,19.38 19.9,19.49 LP$4.$4 | U$16.OUT 38.9,12.93 39.4,12.62 39.4,10.62 39.15,10.38 v38.52,9.5
  Bottom 0.3: U$11.OUT 36.66,15.62 38.4,15.62 | 38.4,15.62 40.02,15.62 40.34,15.95 U$12.OUT | U$16.OUT 38.4,13.38 38.4,15.62
D$16  (via drill 0.2)
  Top 0.125: 23.52,14 v23.4,13.88 23.27,14 22.52,14 22.02,14.5 TP2.TP | U$1.5 72.95,15.32 72.53,15.75 69.78,15.75 v69.65,15.62 | B$5.LF 34.8,12.75 31.65,12.75 31.65,12.25 v29.65,12.25
  Route3 0.125: v69.65,15.62 64.4,10.38 46.27,10.38 44.9,9 38.21,9 v37.86,9.38
  Route14 0.125: v23.4,13.88 24.27,14.62 27.27,14.62 v29.65,12.25 30.77,11.12 36.9,11.12 36.9,9.88 37.27,9.5 37.73,9.5 v37.86,9.38
  Bottom 0.125: v23.4,13.88 23.02,14.12 22.34,14.12 21.21,15 21.21,15.62 LP$12.$4
D$17  (via drill 0.2)
  Route3 0.125: v70.15,15.25 69.65,14.75 69.28,14.75 64.53,10 46.52,10 45.15,8.62 37.9,8.62 36.9,9.62 v35.9,10.12
  Route14 0.125: v35.9,10.12 35.9,10 35.52,9.62 30.15,9.62 29.27,10.5 26.65,10.5 26.02,11.12 v26.02,11.5
  Bottom 0.125: v26.02,11.5 26.02,11 26.52,10.13 LP$11.$4 | U$1.6 70.22,15.32 v70.15,15.25 | R$29.IN 36.9,11 v35.9,10.12
D$18  (via drill 0.2)
  Top 0.125: v28.4,11.62 27.52,11.62 26.9,12.25 LP$19.$4 | U$1.3 72.88,14.53 72.4,15 70.78,15 v70.65,14.88
  Route3 0.125: v70.65,14.88 70.15,14.38 69.4,14.38 64.65,9.62 48.9,9.62 47.52,8.25 | 47.52,8.25 35.4,8.25 35.15,8.5 v35.15,10.12 | v48.15,7.75 47.52,8.25
  Route14 0.125: v35.15,10.12 30.27,10.12 28.77,11.62 v28.4,11.62
  Bottom 0.125: B$10.LF 48.15,8.25 v48.15,7.75 | v35.15,10.12 R$30.IN
D$19  (via drill 0.2)
  Route3 0.125: v71.15,14.5 70.65,14 69.53,14 64.78,9.25 50.4,9.25 47.9,6.75 47.15,6.75 46.02,7.88 33.15,7.88 28.77,12.25 25.65,12.25 v25.4,11.88
  Bottom 0.125: U$1.4 73.03,14.5 72.88,14.65 71.3,14.65 v71.15,14.5 | v25.4,11.88 25.77,12.26 LP$24.$4 26.4,12.76 26.4,14 28.9,14 29.02,14.12 29.02,16.25 28.97,16.43 R$19.IN
D$20  (via drill 0.2)
  Top 0.125: v26.9,16.38 26.27,15.75 LP$18.$4 | U$1.1 73.05,13.72 72.9,13.88 72.78,13.88 72.4,14.25 71.78,14.25 v71.65,14.12
  Route3 0.125: v71.65,14.12 71.15,13.62 69.65,13.62 64.9,8.88 50.65,8.88 48.15,6.38 46.9,6.38 45.77,7.5 32.9,7.5 29.52,10.88 25.77,10.88 24.77,11.75 24.77,14.38 v26.9,16.38
  Bottom 0.125: v26.9,16.38 28.27,17.75 28.27,18.62 R$20.IN
D$21  (via drill 0.2)
  Top 0.125: 28.17,17.88 28.57,18.27 B$6.LF 28.69,18.12 27.52,18.12 v27.52,17.62
  Route3 0.125: v72.15,13.75 71.65,13.25 69.78,13.25 65.03,8.5 50.9,8.5 48.4,6 46.65,6 45.52,7.12 32.65,7.12 29.27,10.5 25.65,10.5 24.4,11.62 24.4,14.75 v27.52,17.62
  Bottom 0.125: v27.52,17.62 25.77,16 25.77,15.63 LP$23.$4 | U$1.2 72.25,13.72 v72.15,13.75
D$22  (via drill 0.2)
  Route3 0.125: v72.15,25.75 71.28,26.62 69.9,26.62 64.65,31.88 50.15,31.88 48.15,33.88 46.9,33.88 45.77,32.75 34.4,32.75 25.77,24.12 v25.77,24
  Bottom 0.125: LP$22.$4 25.77,24.75 v25.77,24 28.52,21.25 28.52,20.75 R$22.IN | U$1.24 72.3,25.73 v72.15,25.75
D$23  (via drill 0.2)
  Top 0.125: v26.77,24 26.77,24.5 LP$17.$4 | U$1.23 73,25.73 72.53,25.25 71.78,25.25 v71.65,25.38
  Route3 0.125: v71.65,25.38 70.9,26.12 69.65,26.12 64.4,31.38 50.02,31.38 47.9,33.5 47.27,33.5 46.15,32.38 34.77,32.38 26.77,24.38 v26.77,24
  Bottom 0.125: v26.77,24 26.77,23.5 28.65,21.62 R$23.IN
D$24  (via drill 0.2)
  Route3 0.125: v71.15,25 70.4,25.75 69.28,25.75 64.15,30.88 49.65,30.88 v47.77,32.88
  Route14 0.125: v47.77,32.88 46.27,31.75 28.15,31.75 24.77,28.62 24.77,27.38 v25.65,26.25
  Bottom 0.125: B$7.LF 48.15,32.12 48.4,32.38 47.59,32.56 v47.77,32.88 | LP$21.$4 25.65,27 v25.65,26.25 28.77,26.25 29.02,26 29.02,24.25 28.97,24.2 R$24.IN | U$1.22 71.22,24.93 v71.15,25
DC$1  (via drill 0.2)
  Top 0.125: v35.15,26.12 U$6.DC$01
  Bottom 0.125: R$1.OUT v35.15,26.12
DC$3  (via drill 0.2)
  Top 0.125: v36.9,25.75 U$6.DC§03
  Bottom 0.125: R$3.OUT v36.9,25.75
DC$5
  Top 0.15: U$6.RF$04_G21 39.15,25.88 | 40.65,25.88 U$6.RF$04_G22
  Top 0.5: B$2.OUT 39.9,26.88 | 39.9,26.88 39.15,25.88 | 39.9,26.88 40.65,25.88
DC$6  (via drill 0.2)
  Top 0.125: v41.65,26.12 U$6.DC§06
  Bottom 0.125: R$6.OUT v41.65,26.12
DC$10
  Top 0.1: U$6.RF$09_G34 44.15,17.75 | U$6.RF$09_G31 44.15,22.5 | U$6.RF$09_G32 44.15,20.88 | U$6.RF$09_G33 44.15,19.38
  Top 0.5: B$3.OUT 45.65,20.12 | 45.65,20.12 44.9,20.88 | 44.9,19.38 45.65,20.12 | 44.15,17.75 44.9,18.38 44.9,19.38 | 44.15,22.5 44.9,21.88 44.9,20.88 | 44.15,20.88 44.9,20.88 | 44.15,19.38 44.9,19.38
DC$13  (via drill 0.2)
  Top 0.125: v41.65,14 U$6.DC$13
  Bottom 0.125: R$12.OUT v41.65,14
DC$19  (via drill 0.2)
  Top 0.125: v32.02,17 33.02,17 U$6.DC§19
  Bottom 0.125: R$19.OUT 31.9,17.12 v32.02,17
DC$20  (via drill 0.2)
  Top 0.125: v32.65,18.62 U$6.DC§20
  Bottom 0.125: R$20.OUT v32.65,18.62
DC$24  (via drill 0.2)
  Top 0.125: v32.02,23.25 33.02,23.25 U$6.DC§24
  Bottom 0.125: R$24.OUT 31.9,23.12 v32.02,23.25
GND  (via drill 0.2, 0.4, 2.1, 2.1 pad 4, 3)  (3 unrouted)
  Top 0.3: U$6.GND$3 38.4,24.5 | 38.4,24.5 U$6.GND$4 | 38.4,24.5 U$6.GND$1 38.4,27.62 | U$6.GND$6 38.4,15.75 | 38.4,15.75 U$6.GND$5 | U$6.GND$2 38.4,15.75
  other vias: 30.4,36.62 30.4,36.12 30.4,35.62 30.4,35.12 30.4,34.62 30.4,34.12 30.4,33.62 29.52,36.62 29.52,36.12 29.52,35.62 29.52,35.12 29.52,34.62 29.52,34.12 29.52,33.62 28.77,33.62 28.77,34.12 28.77,34.62 28.77,35.12 28.77,35.62 28.77,36.12 28.77,36.62 52.21,24.12 52.71,24.12 53.21,24.12 53.71,24.12 54.21,24.12 54.71,24.12 55.21,24.12 52.21,23.12 52.71,23.12 53.21,23.12 53.71,23.12 54.21,23.12 54.71,23.12 55.21,23.12 52.21,22.12 52.71,22.12 53.21,22.12 53.71,22.12 54.21,22.12 54.71,22.12 55.21,22.12 52.15,18.12 52.65,18.12 53.15,18.12 53.65,18.12 54.15,18.12 54.65,18.12 55.15,18.12 52.15,17.12 52.65,17.12 53.15,17.12 53.65,17.12 54.15,17.12 54.65,17.12 55.15,17.12 52.15,16.12 52.65,16.12 53.15,16.12 53.65,16.12 54.15,16.12 54.65,16.12 55.15,16.12 61.02,24.12 61.52,24.12 62.02,24.12 62.52,24.12 63.02,24.12 63.52,24.12 64.03,24.12 61.02,23.12 61.52,23.12 62.02,23.12 62.52,23.12 63.02,23.12 63.52,23.12 64.03,23.12 61.02,22.12 61.52,22.12 62.02,22.12 62.52,22.12 63.02,22.12 63.52,22.12 64.03,22.12 61.02,18.12 61.52,18.12 62.02,18.12 62.52,18.12 63.02,18.12 63.52,18.12 64.03,18.12 61.02,17.12 61.52,17.12 62.02,17.12 62.52,17.12 63.02,17.12 63.52,17.12 64.03,17.12 61.02,16.12 61.52,16.12 62.02,16.12 62.52,16.12 63.02,16.12 63.52,16.12 64.03,16.12 32.9,36.62 32.9,36.12 32.9,35.62 32.9,35.12 32.9,34.62 32.9,34.12 32.9,33.62 32.02,36.62 32.02,36.12 32.02,35.62 32.02,35.12 32.02,34.62 32.02,34.12 32.02,33.62 31.27,33.62 31.27,34.12 31.27,34.62 31.27,35.12 31.27,35.62 31.27,36.12 31.27,36.62 36.9,36.62 36.9,36.12 36.9,35.62 36.9,35.12 39.9,36.62 39.9,36.12 39.9,35.62 39.9,35.12 37.77,36.62 37.77,36.12 37.77,35.62 37.77,35.12 39.02,35.12 39.02,35.62 39.02,36.12 39.02,36.62 43.9,36.62 43.9,36.12 43.9,35.62 43.9,35.12 43.9,34.62 43.9,34.12 43.9,33.62 44.77,33.62 44.77,34.12 44.77,34.62 44.77,35.12 44.77,35.62 44.77,36.12 44.77,36.62 45.65,34.12 45.65,34.62 45.65,35.12 45.65,35.62 45.65,36.12 45.65,36.62 36.9,5.12 36.9,4.62 36.9,4.12 36.9,3.62 37.77,5.12 37.77,4.62 37.77,4.12 37.77,3.62 39.9,5.12 39.9,4.62 39.9,4.12 39.9,3.62 39.02,3.62 39.02,4.12 39.02,4.62 39.02,5.12 43.9,6.62 43.9,6.12 43.9,5.62 43.9,5.12 43.9,4.62 43.9,4.12 43.9,3.62 44.77,3.62 44.77,4.12 44.77,4.62 44.77,5.12 44.77,5.62 44.77,6.12 44.77,6.62 45.65,6.12 45.65,5.62 45.65,5.12 45.65,4.62 45.65,4.12 45.65,3.62 24.52,18.12 24.02,18.12 23.52,18.12 23.02,18.12 22.52,18.12 22.02,18.12 21.52,18.12 21.02,18.12 24.65,22.12 24.15,22.12 23.65,22.12 23.15,22.12 22.65,22.12 22.15,22.12 21.65,22.12 21.15,22.12 21.02,17.38 21.52,17.38 22.02,17.38 22.52,17.38 23.02,17.38 23.52,17.38 24.02,17.38 24.52,17.38 20.52,18.12 20.65,22.12 24.65,22.88 24.15,22.88 23.65,22.88 23.15,22.88 22.65,22.88 22.15,22.88 21.65,22.88 21.15,22.88 20.65,22.88 4.02,29.5 4.02,28.62 4.02,27.75 4.02,26.88 4.02,26 4.02,25.12 4.02,24.25 4.02,23.38 4.02,22.5 4.02,21.62 4.02,20.75 4.02,19.88 4.02,19 4.02,18.12 4.02,17.25 4.02,16.38 4.02,15.5 4.02,14.62 4.02,13.75 4.02,12.88 4.02,12 4.02,11.12 41.9,39.2 43.27,39.2 40.52,39.2 39.15,39.2 37.77,39.2 36.4,39.2 35.02,39.2 33.65,39.2 32.27,39.2 30.9,39.2 29.52,39.2 28.15,39.2 26.77,39.2 25.4,35 24.02,35 22.65,35 21.27,35 19.9,35 18.52,35 17.15,35 15.77,35 14.4,35 13.02,35 11.65,35 10.27,35 44.65,39.2 46.02,39.2 47.4,39.2 48.77,39.2 50.15,39.2 51.52,39.2 52.9,39.2 54.27,39.2 55.65,39.2 57.02,39.2 58.4,39.2 59.77,39.2 61.15,39.2 62.52,39.2 63.9,39.2 65.4,39.2 25.52,32 24.77,32 24.02,32 23.27,32 22.52,32 21.77,32 21.02,32 20.27,32 19.52,32 54.02,32.75 54.77,32.75 55.52,32.75 56.27,32.75 57.02,32.75 57.77,32.75 58.52,32.75 59.27,32.75 60.02,32.75 60.77,32.75 54.02,7.62 54.77,7.62 55.52,7.62 56.27,7.62 57.02,7.62 57.77,7.62 58.52,7.62 59.27,7.62 60.02,7.62 60.77,7.62 19.4,8.25 20.15,8.25 20.9,8.25 21.65,8.25 22.4,8.25 23.15,8.25 23.9,8.25 24.65,8.25 25.4,8.25 26.15,8.25 26.9,8.25 27.65,8.25 10.27,1.05 11.65,1.05 13.02,1.05 14.4,1.05 15.77,1.05 17.15,1.05 18.52,1.05 19.9,1.05 21.27,1.05 22.65,1.05 24.02,1.05 25.4,1.05 26.77,1.05 28.15,1.05 29.52,1.05 30.9,1.05 32.27,1.05 33.65,1.05 35.02,1.05 36.4,1.05 37.77,1.05 39.15,1.05 40.52,1.05 41.9,1.05 43.27,1.05 44.65,1.05 46.02,1.05 47.4,1.05 48.77,5.25 50.15,5.25 51.52,5.25 52.9,5.25 54.27,5.25 55.65,5.25 57.02,5.25 58.4,5.25 59.77,5.25 61.15,5.25 62.52,5.25 63.9,5.25 65.28,5.25 68.9,19.75 67.53,19.75 23.4,13.25 23.4,12.62 19.9,18.38 19.4,18.38 18.9,18.38 19.9,22.12 19.4,22.12 18.9,22.12 23.27,27.25 23.52,26.88 22.65,29.38 28.52,29.38 22.27,27.12 28.02,27.5 22.27,24.75 22.65,12.62 22.02,10.62 28.27,12.88 28.27,15.38 66.9,39.2 68.4,39.2 68.4,37.95 68.4,36.58 68.4,35.33 66.65,5.25 68.03,1.05 68.03,2.3 68.03,3.55 68.03,4.93 4.5,34.83 4.5,5.43 46.4,36.62 46.4,36.12 46.4,35.62 47.27,35.62 47.27,36.12 47.27,36.62 48.15,35.62 48.15,36.12 48.15,36.62 46.52,3.62 46.52,4.12 46.52,4.62 47.4,4.62 47.4,4.12 47.4,3.62 30.4,6.62 30.4,6.12 30.4,5.62 30.4,5.12 30.4,4.62 30.4,4.12 30.4,3.62 29.52,6.62 29.52,6.12 29.52,5.62 29.52,5.12 29.52,4.62 29.52,4.12 29.52,3.62 28.77,3.62 28.77,4.12 28.77,4.62 28.77,5.12 28.77,5.62 28.77,6.12 28.77,6.62 32.9,6.62 32.9,6.12 32.9,5.62 32.9,5.12 32.9,4.62 32.9,4.12 32.9,3.62 32.02,6.62 32.02,6.12 32.02,5.62 32.02,5.12 32.02,4.62 32.02,4.12 32.02,3.62 31.27,3.62 31.27,4.12 31.27,4.62 31.27,5.12 31.27,5.62 31.27,6.12 31.27,6.62 61.02,15.25 61.52,15.25 62.02,15.25 62.52,15.25 61.02,14.25 61.52,14.25 62.02,14.25 62.52,14.25 61.02,26 61.52,26 62.02,26 62.52,26 61.02,25 61.52,25 62.02,25 62.52,25 37.74,10.84 38.23,11.32 37.75,11.32 38.75,11.32 38.51,10.38 38.24,10.84 37.71,29.51 38.17,29.5 38.62,29.49 39.08,29.51 39.1,29.01 38.64,29 38.19,28.99 37.73,28.99 10.2,37.62 24.3,37.62 50.33,2.62 64.42,2.62 28.4,24 27.9,24 27.4,24 38.77,10.84 37.98,10.45
  pour Top (rank 6): -4.85,41.73 81.6,41.83 81.6,-2.57 -4.85,-2.68
  pour Route2 (rank 6): -7.5,43.23 82.1,43.73 82.1,-3.02 -7.5,-3.52
  pour Route15 (rank 6): -11.25,46.62 84.4,46.62 84.4,-9.27 -11.25,-9.27
  pour Route3 (rank 6): -15.4,49.92 85.9,49.92 85.9,-11.73 -15.4,-11.62
  pour Bottom (rank 6): -16.65,51.42 86.65,51.33 86.65,-13.73 -16.65,-13.62
  pour Route14 (rank 6): -12.9,47.42 85.4,47.33 85.4,-10.73 -12.9,-10.62
N$1
  Top 0.5: B$6.HF S$1.1
N$2  (via drill 0.2)  (3 unrouted)
  Bottom 0.5: L$3.OUT 41.38,16.98 41.38,16.9 U$12.IN
  other vias: 42.27,16.24 42.61,15.95
N$3
  Top 0.15: 36.15,25.88 U$6.RF$02_G11 | U$6.RF$02_G12 37.65,25.88
  Top 0.5: B$1.OUT 36.9,26.88 | 36.9,26.88 36.15,25.88 | 37.65,25.88 36.9,26.88
N$4  (via drill 0.2)
  Top 0.125: v44.77,23.25 43.77,23.25 U$6.DC§07
  Bottom 0.125: R$25.OUT 44.9,23.12 v44.77,23.25
N$5
  Top 0.3: 36.9,31.57 B$1.HF
  Top 0.5: S$7.1 34.9,31.88 arc90 35.4,32.38 arc-90 36.15,33.12 arc-67 36.9,32.62 B$1.HF
N$6
  Top 0.3: 39.9,31.57 B$2.HF
  Top 0.5: S$6.1 41.9,31.88 arc-90 41.4,32.38 arc90 40.65,33.12 arc67 39.9,32.62 B$2.HF
N$7
  Top 0.1: 39.15,14.38 U$6.RF$14_G42 | U$6.RF$14_G41 40.65,14.38
  Top 0.5: B$4.OUT 39.9,13.38 | 39.9,13.38 39.15,14.38 | 40.65,14.38 39.9,13.38
N$8
  Top 0.1: 36.15,14.38 U$6.RF$16_G52 | U$6.RF$16_G51 37.65,14.38
  Top 0.5: B$5.OUT 36.9,13.38 | 36.9,13.38 36.15,14.38 | 37.65,14.38 36.9,13.38
N$9  (via drill 0.2)  (3 unrouted)
  Bottom 0.5: L$4.OUT 35.43,16.99 35.43,16.9 U$11.IN
  other vias: 34.54,16.24 34.19,15.95
N$10  (via drill 0.2)  (3 unrouted)
  Bottom 0.5: L$1.OUT 35.39,23.29 35.39,23.35 U$14.IN
  other vias: 34.53,24.02 34.19,24.3
N$11  (via drill 0.2)  (3 unrouted)
  Bottom 0.5: L$2.OUT 41.44,23.32 41.44,23.35 U$13.IN
  other vias: 42.61,24.3 42.27,24.02
N$12  (via drill 0.2)
  Top 0.125: v44.15,21.62 U$6.DC§08
  Bottom 0.125: R$7.OUT v44.15,21.62
N$13
  Bottom 0.125: 45.4,13.38 45.77,13.38 U$9.IN
  Bottom 0.3: B$9.OUT 45.4,13.38 L$3.IN
N$14
  Bottom 0.3: B$8.OUT 45.65,26.88 | L$2.IN 45.46,26.88 45.65,26.88 | U$10.IN 45.77,27 45.65,26.88
N$15
  Bottom 0.3: B$9.HF 51.97,13.38 arc-46 52.7,13.07 52.79,12.97 arc-44 52.87,12.76 U$5.P$3
N$16
  Top 0.3: 36.9,8.68 B$5.HF
  Top 0.5: S$2.1 34.9,8.38 arc-90 35.4,7.88 arc90 36.15,7.12 arc67 36.9,8.12 B$5.HF
N$17
  Top 0.3: 39.9,8.68 B$4.HF
  Top 0.5: S$3.1 41.9,8.38 arc90 41.4,7.88 arc-90 40.65,7.12 arc-67 39.9,8.12 B$4.HF
N$18
  Top 0.5: B$3.HF S$4.1
N$19
  Bottom 0.3: B$7.HF 51.96,30.38 arc-47 52.7,30.05 52.79,29.95 arc-43 52.87,29.75 U$3.P$3
N$20
  Top 0.1: 32.52,20.88 32.65,20.88 U$6.RF$21_G63 | U$6.RF$21_G64 32.65,22.5 | U$6.RF$21_G62 32.65,19.38 | 32.65,17.75 U$6.RF$21_G61
  Top 0.5: B$6.OUT 31.15,20.12 | 32.65,22.5 31.9,21.88 31.9,20.88 | 31.9,20.88 32.65,20.88 | 31.9,20.88 31.15,20.12 | 31.9,19.38 31.15,20.12 | 32.65,19.38 31.9,19.38 | 31.9,19.38 31.9,18.38 32.65,17.75
N$21  (1 unrouted)
  Bottom 0.3: 62.65,20.12 U$4.P$1
N$22
  Bottom 0.3: B$10.HF 51.97,9.88 arc47 52.7,10.19 52.79,10.29 arc43 52.87,10.49 U$5.P$2
N$23
  Bottom 0.3: B$8.HF 51.97,26.88 arc47 52.7,27.19 52.79,27.29 arc43 52.87,27.49 U$3.P$2
N$24  (via drill 0.2)
  Top 0.125: v44.4,20.12 U$6.DC§10
  Bottom 0.125: R$9.OUT v44.4,20.12
N$25
  Bottom 0.3: U$3.P$1 56.63,28.62 arc-90 58.63,26.62 U$4.P$3
N$26
  Bottom 0.3: U$5.P$1 56.62,11.62 arc90 58.62,13.62 U$4.P$2
N$27  (via drill 0.2)
  Top 0.125: v44.15,18.62 U$6.DC§11
  Bottom 0.125: R$10.OUT v44.15,18.62
N$28  (via drill 0.2)
  Top 0.125: v44.77,17 44.15,17 U$6.DC§12
  Bottom 0.125: R$11.OUT 44.9,17.12 v44.77,17
N$30  (via drill 0.2)
  Top 0.125: v36.9,14.5 U$6.DC§17
  Bottom 0.125: R$29.OUT v36.9,14.5
N$31  (via drill 0.2)
  Top 0.125: v35.15,14 U$6.DC§18
  Bottom 0.125: R$30.OUT v35.15,14
N$32  (via drill 0.2)
  Top 0.125: v32.4,20.12 U$6.DC§22
  Bottom 0.125: R$22.OUT v32.4,20.12
N$33  (via drill 0.2)
  Top 0.125: v32.65,21.62 U$6.DC§23
  Bottom 0.125: R$23.OUT v32.65,21.62
N$34
  Top 0.15: 32.65,20.88 33.15,20.88
RF$3
  Bottom 0.125: U$8.IN 31.15,12
  Bottom 0.3: B$10.OUT 46.77,9.88 45.4,8.5 33.77,8.5 31.15,11.12 31.15,12 31.15,13.31 L$4.IN
RF$4
  Bottom 0.3: B$7.OUT 46.77,30.38 45.4,31.75 33.77,31.75 31.15,29.12 31.15,28.25 | 31.15,28.25 31.15,27.07 L$1.IN | U$7.IN 31.15,28.25
S$1  (via drill 0.2)  (5 unrouted)
  other vias: 59.59,20.12 60.15,20.12 62.65,20.12 62.02,20.12 61.4,20.12 60.77,20.12
S$165
  cutout Route2: 44.46,11.63 42.9,11.62 38.65,11.62 38.65,13.62 38.15,13.62 38.15,11.62 32.4,11.62 29.4,14.62 29.4,25.62 32.4,28.62 38.15,28.62 38.15,26.62 38.65,26.62 38.65,28.62 44.4,28.62 47.4,25.62 47.4,14.62
  cutout Route3: 44.46,11.63 42.9,11.62 38.65,11.62 38.65,13.62 38.15,13.62 38.15,11.62 32.4,11.62 29.4,14.62 29.4,19.62 29.4,20.62 29.4,25.62 32.4,28.62 38.15,28.62 38.15,26.62 38.65,26.62 38.65,28.62 44.4,28.62 47.4,25.62 47.4,20.62 47.4,19.62 47.4,14.62
  cutout Route14: 44.46,11.63 42.9,11.62 38.65,11.62 38.65,13.62 38.15,13.62 38.15,11.62 32.4,11.62 29.4,14.62 29.4,19.62 29.4,20.62 29.4,25.62 32.4,28.62 38.15,28.62 38.15,26.62 38.65,26.62 38.65,28.62 44.4,28.62 47.4,25.62 47.4,20.62 47.4,19.62 47.4,14.62
  cutout Route15: 44.46,11.63 42.9,11.62 38.65,11.62 38.65,13.62 38.15,13.62 38.15,11.62 32.4,11.62 29.4,14.62 29.4,19.62 29.4,20.62 29.4,25.62 32.4,28.62 38.15,28.62 38.15,26.62 38.65,26.62 38.65,28.62 44.4,28.62 47.4,25.62 47.4,20.62 47.4,19.62 47.4,14.62
  cutout Top: 44.46,11.63 42.9,11.62 38.65,11.62 38.65,13.62 38.15,13.62 38.15,11.62 32.4,11.62 29.4,14.62 29.4,19.62 29.4,20.62 29.4,25.62 32.4,28.62 38.15,28.62 38.15,26.62 38.65,26.62 38.65,28.62 44.4,28.62 47.4,25.62 47.4,20.62 47.4,19.62 47.4,14.62
  cutout Bottom: 44.46,11.63 42.9,11.62 32.4,11.62 29.4,14.62 29.4,19.62 29.4,20.62 29.4,25.62 32.4,28.62 44.4,28.62 47.4,25.62 47.4,20.62 47.4,19.62 47.4,14.62

### Text on the board
tPlace: G1 | G2 | 8 | 9 | 6 | RF-BOARD V3.3 / Iron Man | 1 | 23 | 4 | 23 | 1 | 3 | G3 | 5 | 9 | 7 | G6 | NO / SILVER / PASTE / OUTSIDE / THIS / AREA !! | 10 | 15 | 12 | 16 | 20 | 14 | 13 | 14 | 16 | 18 | 20 | 18 | 13 | 10 | IST Austria | 11 | G5 | G4
bPlace: 01 | 03 | 02 | 04 | 2 | 05 | 06 | 7 | 08 | 24 | 5 | 22 | 07 | 10 | 22 | 24 | 09 | 3 | 2 | 11 | 12 | 4 | 13 | 6 | 15 | 8 | 15 | 14 | 17 | 19 | 16 | 16 | 11 | 18 | 13 | 15 | 21 | 20 | 21 | 17 | 22 | 14 | 19 | 23 | 24 | 21 | 19 | 25 | 12 | 17
CopperPlate: tell beta to put Cu on walls here | tell beta to put Cu on walls here | tell beta to put Cu on walls here | tell beta to put Cu on walls here